# Altium schematic sheet ct_micro.SchDoc: Microcontroller
size Letter; Organization: NewAE Technology Inc.; Address1: 1083 Queen St., Suite 196; Address2: Halifax; Address3: NS; Address4: Canada B3H 0B2; SheetNumber: 5; SheetTotal: 8; SheetApproved: YES
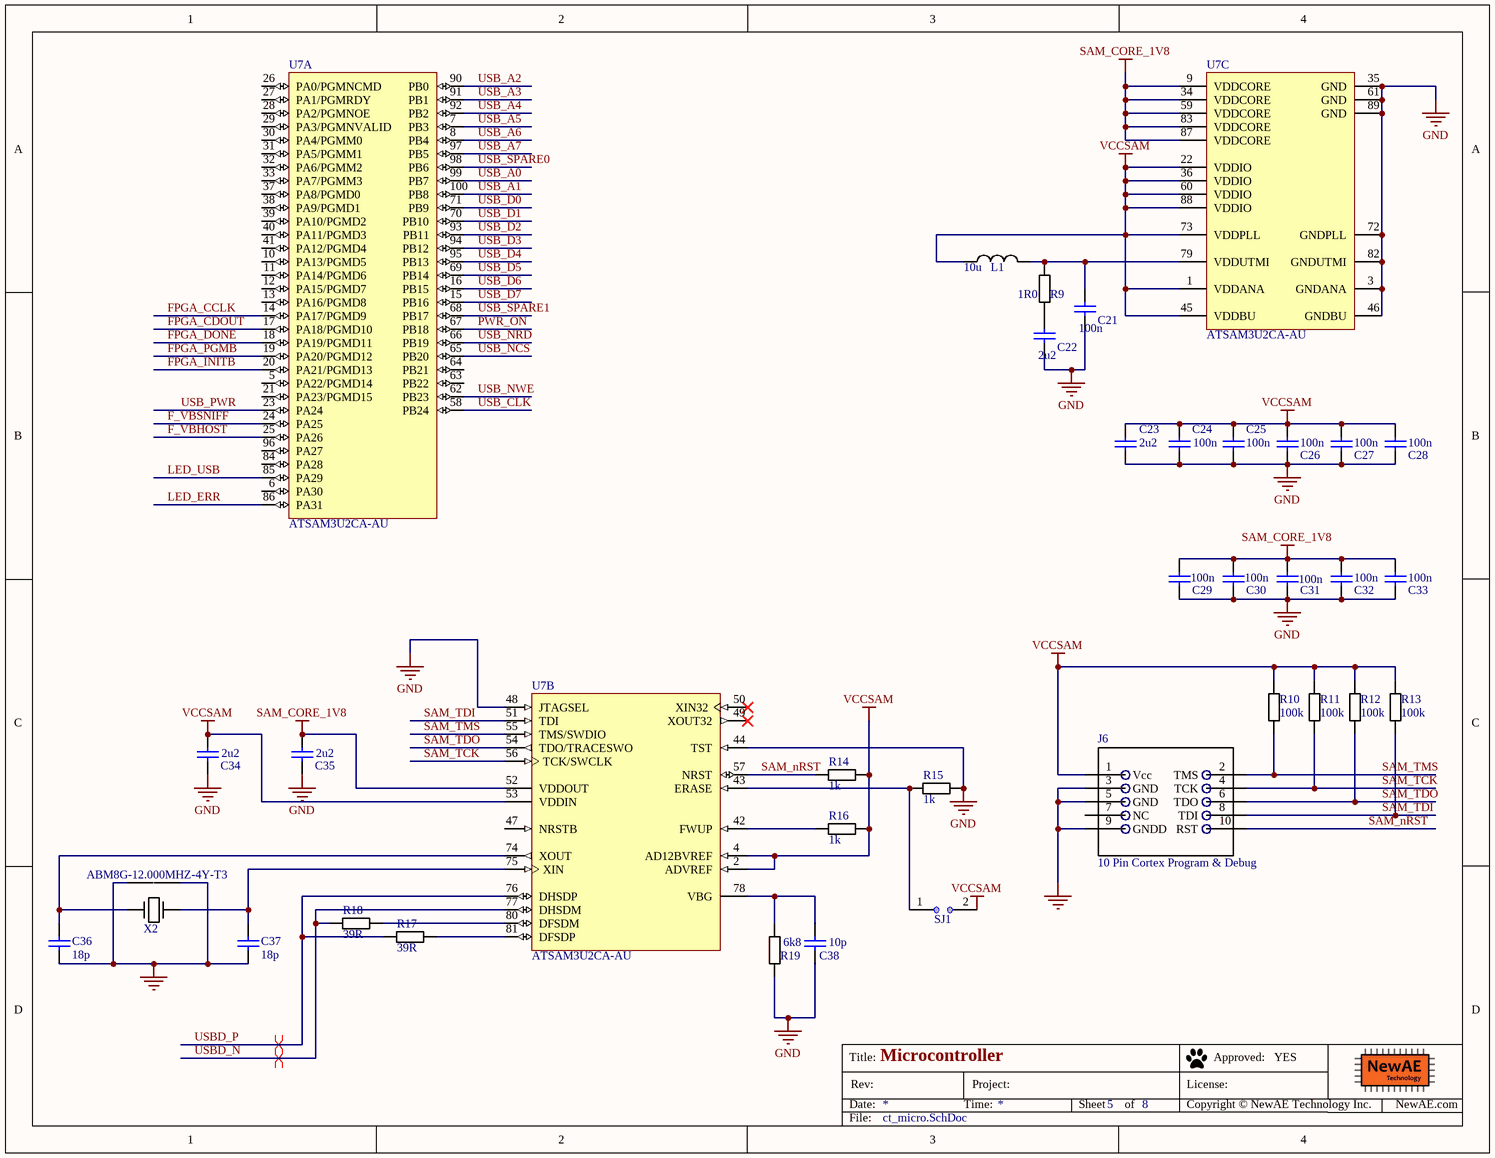
[diagram p0: ct_micro.SchDoc]

## Parts
C21  100n  [CAPC0402_M]
C22  2u2  [CAPC0603_M]
C23  2u2  [CAPC0603_M]
C24  100n  [CAPC0402_M]
C25  100n  [CAPC0402_M]
C26  100n  [CAPC0402_M]
C27  100n  [CAPC0402_M]
C28  100n  [CAPC0402_M]
C29  100n  [CAPC0402_M]
C30  100n  [CAPC0402_M]
C31  100n  [CAPC0402_M]
C32  100n  [CAPC0402_M]
C33  100n  [CAPC0402_M]
C34  2u2  [CAPC0603_M]
C35  2u2  [CAPC0603_M]
C36  18p  [CAPC0402_M]
C37  18p  [CAPC0402_M]
C38  10p  [CAPC0603_M]
J6  10 Pin Cortex Program & Debug  [0.5mm_SMD_Header_5x2]
L1  10u  [IND_0603]
R9  1R0  [RESC1608X55N]
R10  100k  [RESC1608X55N]
R11  100k  [RESC1608X55N]
R12  100k  [RESC1608X55N]
R13  100k  [RESC1608X55N]
R14  1k  [RESC1608X55N]
R15  1k  [RESC1608X55N]
R16  1k  [RESC1608X55N]
R17  39R  [RESC1608X55N]
R18  39R  [RESC1608X55N]
R19  6k8  [RESC1608X55N]
SJ1  NO  [SJ_2S_NO]  (value not drawn)  (no BOM)
U7  ATSAM3U2CA-AU  [LQFP100_L]  (parts A,B,C of 3)
X2  ABM8G-12.000MHZ-4Y-T3  [ABM8G]

## Nets
GND: C21.2 C22.2 C23.2 C24.2 C25.2 C26.2 C27.2 C28.2 C29.2 C30.2 C31.2 C32.2 C33.2 C34.2 C35.2 C36.2 C37.2 C38.2 J6.3(GND) J6.5(GND) J6.9(GNDD) R15.2 R19.2 U7.3(GNDANA) U7.35(GND) U7.44(TST) U7.46(GNDBU) U7.48(JTAGSEL) U7.61(GND) U7.72(GNDPLL) U7.82(GNDUTMI) U7.89(GND) X2.2(GND) X2.4(GND)
SAM_CORE_1V8: C29.1 C30.1 C31.1 C32.1 C33.1 C35.1 U7.9(VDDCORE) U7.34(VDDCORE) U7.52(VDDOUT) U7.59(VDDCORE) U7.83(VDDCORE) U7.87(VDDCORE)
VCCSAM: C23.1 C24.1 C25.1 C26.1 C27.1 C28.1 C34.1 J6.1(Vcc) L1.1 R10.1 R11.1 R12.1 R13.1 R14.2 R16.2 SJ1.2 U7.1(VDDANA) U7.2(ADVREF) U7.4(AD12BVREF) U7.22(VDDIO) U7.36(VDDIO) U7.45(VDDBU) U7.53(VDDIN) U7.60(VDDIO) U7.73(VDDPLL) U7.88(VDDIO)
F_VBHOST: U7.25(PA26)
F_VBSNIFF: U7.24(PA25)
FPGA_CCLK: U7.14(PA17/PGMD9)
FPGA_CDOUT: U7.17(PA18/PGMD10)
FPGA_DONE: U7.18(PA19/PGMD11)
FPGA_INITB: U7.20(PA21/PGMD13)
FPGA_PGMB: U7.19(PA20/PGMD12)
LED_ERR: U7.86(PA31)
LED_USB: U7.85(PA29)
PWR_ON: U7.67(PB18)
SAM_nRST: J6.10(RST) R14.1 U7.57(NRST)
SAM_TCK: J6.4(TCK) R11.2 U7.56(TCK/SWCLK)
SAM_TDI: J6.8(TDI) R13.2 U7.51(TDI)
SAM_TDO: J6.6(TDO) R12.2 U7.54(TDO/TRACESWO)
SAM_TMS: J6.2(TMS) R10.2 U7.55(TMS/SWDIO)
USB_A0: U7.99(PB7)
USB_A1: U7.100(PB8)
USB_A2: U7.90(PB0)
USB_A3: U7.91(PB1)
USB_A4: U7.92(PB2)
USB_A5: U7.7(PB3)
USB_A6: U7.8(PB4)
USB_A7: U7.97(PB5)
USB_CLK: U7.58(PB24)
USB_D0: U7.71(PB9)
USB_D1: U7.70(PB10)
USB_D2: U7.93(PB11)
USB_D3: U7.94(PB12)
USB_D4: U7.95(PB13)
USB_D5: U7.69(PB14)
USB_D6: U7.16(PB15)
USB_D7: U7.15(PB16)
USB_NCS: U7.65(PB20)
USB_NRD: U7.66(PB19)
USB_NWE: U7.62(PB23)
USB_PWR: U7.23(PA24)
USB_SPARE0: U7.98(PB6)
USB_SPARE1: U7.68(PB17)
USBD_N: R18.1 U7.77(DHSDM)
USBD_P: R17.1 U7.76(DHSDP)
NetC21_1: C21.1 L1.2 R9.1 U7.79(VDDUTMI)
NetC22_1: C22.1 R9.2
NetC36_1: C36.1 U7.74(XOUT) X2.1(IN)
NetC37_1: C37.1 U7.75(XIN) X2.3(OUT)
NetC38_1: C38.1 R19.1 U7.78(VBG)
NetR15_1: R15.1 SJ1.1 U7.43(ERASE)
NetR16_1: R16.1 U7.42(FWUP)
NetR17_2: R17.2 U7.81(DFSDP)
NetR18_2: R18.2 U7.80(DFSDM)

Not connected (* = marked no-connect by the designer): J6 7(NC); U7 5(PA22/PGMD14) 6(PA30) 10(PA13/PGMD5) 11(PA14/PGMD6) 12(PA15/PGMD7) 13(PA16/PGMD8) 21(PA23/PGMD15) 26(PA0/PGMNCMD) 27(PA1/PGMRDY) 28(PA2/PGMNOE) 29(PA3/PGMNVALID) 30(PA4/PGMM0) 31(PA5/PGMM1) 32(PA6/PGMM2) 33(PA7/PGMM3) 37(PA8/PGMD0) 38(PA9/PGMD1) 39(PA10/PGMD2) 40(PA11/PGMD3) 41(PA12/PGMD4) 47(NRSTB) 49(XOUT32)* 50(XIN32)* 63(PB22) 64(PB21) 84(PA28) 96(PA27)

## Layout directives
differential pair: USBD_N, USBD_P

## Notes on the sheet
- Title:
- Date:
- Rev:
- Time:
- Project:
- Sheet
- of
- License:
- Copyright © NewAE Technology Inc.
- Approved:
- NewAE.com
- File:

## Library data of the parts
C21 C24-C33 = CCHIP-100n-0402: 100n, 0402; Component Group: Capacitor; Case-EIA: 0402; Part Number: CCHIP-100n-0402; Footprint: 0402; Pin Count: 2; Value: 100n; Mounting Technology: SMT; Component Kind: Standard; Component Type: Standard
C22 C23 C34 C35 = CCHIP-2u2-0603: 2u2, 0603; Manufacture 1: Samsung; Manufacture Part Number 1: CL10B225KP8NNNC; Component Group: Capacitor; Case-EIA: 0603; Case-Metric: 1608; Rated Voltage: 10VDC; Part Number: CCHIP-2u2-0603; Footprint: 0603; Pin Count: 2; Supplier 1: Digi-Key; Supplier Part Number 1: 1276-1134-2-ND; Value: 2u2; Mounting Technology: SMT; Component Kind: Standard; Component Type: Standard
C36 C37 = CCHIP-18p-0402: 18p, 0402; Manufacture Part Number 1: GRM1555C1H180JA01D; Component Group: Capacitor; Case-EIA: 0402; Part Number: CCHIP-18p-0402; Footprint: 0402; Pin Count: 2; Value: 18p; Mounting Technology: SMT; Component Kind: Standard; Component Type: Standard
C38 = CCHIP-10p-0603: 10p, 0603; Component Group: Capacitor; Case-EIA: 0603; Case-Metric: 1608; Part Number: CCHIP-10p-0603; Footprint: 0603; Pin Count: 2; Supplier 1: Digi-Key; Supplier Part Number 1: 399-1049-1-ND; Value: 10p; Mounting Technology: SMT; Component Kind: Standard; Component Type: Standard
J6 = Cortex_Debug_Header_10Pin: 10 Pin Cortex Program & Debug 0.5mm pitch; Manufacture Part Number 1: 20021121-00010C4LF; Component Group: Connector; PP Material Stack: 0; Part Number: Cortex_Debug_Header_10Pin; Pin Count: 10; Supplier 1: Digi-Key; Supplier Part Number 1: 609-3695-1-ND; Mounting Technology: SMT; RoHS: Yes; Component Kind: Standard; Component Type: Standard; PP Rotation: 0
L1 = LCHIP-10U-0603: FIXED IND 10UH 50MA 900 MOHM SMD; Manufacture 1: Murata Electronics North America; Manufacture Part Number 1: LQM18FN100M00D; Component Group: Inductor; Case-EIA: 0603; Case-Metric: 1608; Tolerance: ±20%; PP Material Stack: 0; Part Number: LCHIP-10U-0603; Footprint: 0603; Pin Count: 2; Supplier 1: Digi-Key; Supplier Part Number 1: 490-4025-1-ND; Value: 10u; Mounting Technology: SMT; Component Kind: Standard; Component Type: Standard; PP Rotation: 0
R9 = RCHIP-1R0-0603: 1R0 res, 0603, 1%, 1/10W; Manufacture 1: Yageo; Manufacture Part Number 1: RC0603FR-071RL; Component Group: Resistor; Case-EIA: 0603; Case-Metric: 1608; Rated Power: 0.1W; Rated Voltage: 75VDC; Part Number: RCHIP-1R0-0603; Footprint: 0603; Pin Count: 2; Supplier 1: Digi-Key; Supplier Part Number 1: 311-1.00HRCT-ND; Value: 1R0; Tolerance: 1%; Mounting Technology: SMT; Temperature Range: -55C to 155C; Component Kind: Standard; Component Type: Standard
R10-R13 = RCHIP-100K-0603: 100k res, 0603, 1%, 1/10W; Manufacture 1: Yageo; Manufacture Part Number 1: RC0603FR-07100KL; Component Group: Resistor; Case-EIA: 0603; Case-Metric: 1608; Rated Power: 0.1W; Rated Voltage: 75VDC; Part Number: RCHIP-100K-0603; Footprint: 0603; Pin Count: 2; Supplier 1: Digi-Key; Supplier Part Number 1: 311-100KHRCT-ND; Value: 100k; Tolerance: 1%; Mounting Technology: SMT; Temperature Range: -55C to 155C; Component Kind: Standard; Component Type: Standard
R14-R16 = RCHIP-1K-0603: 1k res, 0603, 1%, 1/10W; Manufacture 1: Yageo; Manufacture Part Number 1: RC0603FR-071KL; Component Group: Resistor; Case-EIA: 0603; Case-Metric: 1608; Rated Power: 0.1W; Rated Voltage: 75VDC; Part Number: RCHIP-1K-0603; Footprint: 0603; Pin Count: 2; Supplier 1: Digi-Key; Supplier Part Number 1: 311-1.00KHRCT-ND; Value: 1k; Tolerance: 1%; Mounting Technology: SMT; Temperature Range: -55C to 155C; Component Kind: Standard; Component Type: Standard
R17 R18 = RCHIP-39R-0603: 39R res, 0603, 1%, 1/10W; Manufacture 1: Yageo; Manufacture Part Number 1: RC0603FR-0739RL; Component Group: Resistor; Case-EIA: 0603; Case-Metric: 1608; Rated Power: 0.1W; Rated Voltage: 75VDC; Part Number: RCHIP-39R-0603; Footprint: 0603; Pin Count: 2; Supplier 1: Digi-Key; Supplier Part Number 1: 311-39.0HRCT-ND; Value: 39R; Tolerance: 1%; Mounting Technology: SMT; Temperature Range: -55C to 155C; Component Kind: Standard; Component Type: Standard
R19 = RCHIP-6K8-0603: 6k8 res, 0603, 1%, 1/10W; Manufacture 1: Yageo; Manufacture Part Number 1: RC0603FR-076K8L; Component Group: Resistor; Case-EIA: 0603; Case-Metric: 1608; Rated Power: 0.1W; Rated Voltage: 75VDC; Part Number: RCHIP-6K8-0603; Footprint: 0603; Pin Count: 2; Supplier 1: Digi-Key; Supplier Part Number 1: 311-6.80KHRCT-ND; Value: 6k8; Tolerance: 1%; Mounting Technology: SMT; Temperature Range: -55C to 155C; Component Kind: Standard; Component Type: Standard
SJ1 = SJ_2S_NO: Solder Jumper, NO; Component Group: PCB Feature; Part Number: SJ_2S_NO; Pin Count: 2; Mounting Technology: COPPER; Component Type: Standard (No BOM)
U7 = CMP-0076-00087-2: AT91 ARM Cortex-M3 32-bit Microcontroller, 128KB Flash, 36KB SRAM, 57 User I/Os, 3USARTs, 100-Pin LQFP, Industrial Grade (-40°C to 85°C), Pb-Free; ComponentLink3URL: http://www.atmel.com/dyn/resources/prod_documents/6430s.pdf; PackageReference: LQFP100; ComponentLink2Description: SAM3U Series Datasheet; Code_JEDEC: MS-026-BED; ComponentLink1Description: Manufacturer URL; PackageVersion: Apr-2006; PackageDescription: 100-Pin Thin Quad Flat Pack 0.5 mm Pitch; DatasheetVersion: revC, Apr-2010; RevisionNote: DatasheetVersion updated. URLs added.; ComponentLink3Description: SAM3U Series Summary; ComponentLink2URL: http://www.atmel.com/dyn/resources/prod_documents/doc6430.pdf; ComponentLink1URL: http://www.atmel.com/; PartId: 1
X2 = ABM8G-12.000MHZ-4Y-T3: CRYSTAL 12.0000MHZ 10PF SMD; Manufacture 1: Abracon LLC; Part Number: ABM8G-12.000MHZ-4Y-T3; Component Group: Crystal; Manufacture Part Number 1: ABM8G-12.000MHZ-4Y-T3; Pin Count: 4; Supplier 1: Digi-Key; Supplier Part Number 1: 535-10901-1-ND; Component Kind: Standard; Component Type: Standard; Value: 12.000MHz